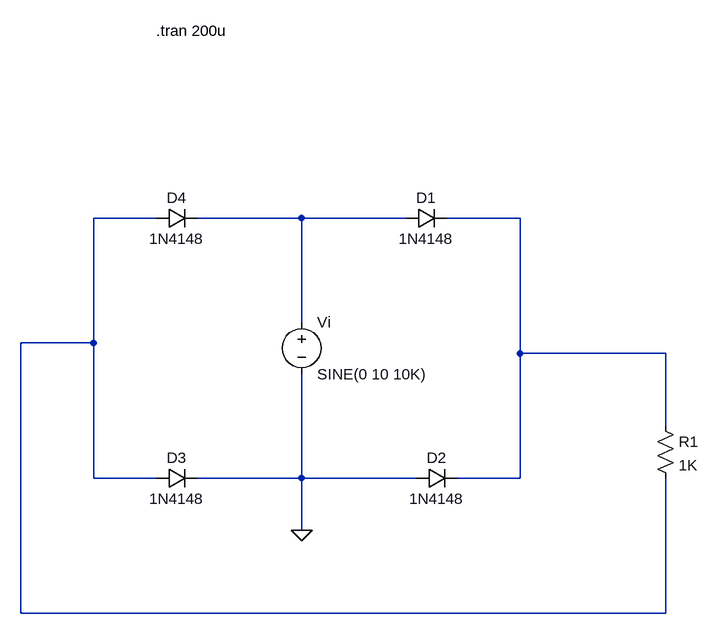
[diagram p0: schematic 121.asc]
121.asc, the LTspice schematic file:
Version 4.1
SHEET 1 880 680
WIRE -240 -224 -336 -224
WIRE -16 -224 -176 -224
WIRE 144 -224 -16 -224
WIRE 320 -224 208 -224
WIRE -16 -64 -16 -224
WIRE -336 -32 -336 -224
WIRE -336 -32 -448 -32
WIRE 320 -16 320 -224
WIRE 544 -16 320 -16
WIRE 544 96 544 -16
WIRE -336 176 -336 -32
WIRE -240 176 -336 176
WIRE -16 176 -16 16
WIRE -16 176 -176 176
WIRE 160 176 -16 176
WIRE 320 176 320 -16
WIRE 320 176 224 176
WIRE -16 256 -16 176
WIRE -448 384 -448 -32
WIRE 544 384 544 176
WIRE 544 384 -448 384
FLAG -16 256 0
SYMBOL voltage -16 -80 R0
WINDOW 123 0 0 Left 0
WINDOW 39 0 0 Left 0
SYMATTR InstName Vi
SYMATTR Value SINE(0 10 10K)
SYMBOL diode -240 -208 R270
WINDOW 0 32 32 VTop 2
WINDOW 3 0 32 VBottom 2
SYMATTR InstName D4
SYMATTR Value 1N4148
SYMBOL diode 144 -208 R270
WINDOW 0 32 32 VTop 2
WINDOW 3 0 32 VBottom 2
SYMATTR InstName D1
SYMATTR Value 1N4148
SYMBOL diode -240 192 R270
WINDOW 0 32 32 VTop 2
WINDOW 3 0 32 VBottom 2
SYMATTR InstName D3
SYMATTR Value 1N4148
SYMBOL diode 160 192 R270
WINDOW 0 32 32 VTop 2
WINDOW 3 0 32 VBottom 2
SYMATTR InstName D2
SYMATTR Value 1N4148
SYMBOL res 528 80 R0
SYMATTR InstName R1
SYMATTR Value 1K
TEXT -240 -512 Left 2 !.tran 200u

The netlist it stands for:
* 121.asc
Vi N002 0 SINE(0 10 10K)
D4 N001 N002 1N4148
D1 N002 N003 1N4148
D3 N001 0 1N4148
D2 0 N003 1N4148
R1 N003 N001 1K
.model D D
.lib standard.dio
.tran 200u
.backanno
.end